# Altium project CW308T_LPC55S69_Target.PrjPcb
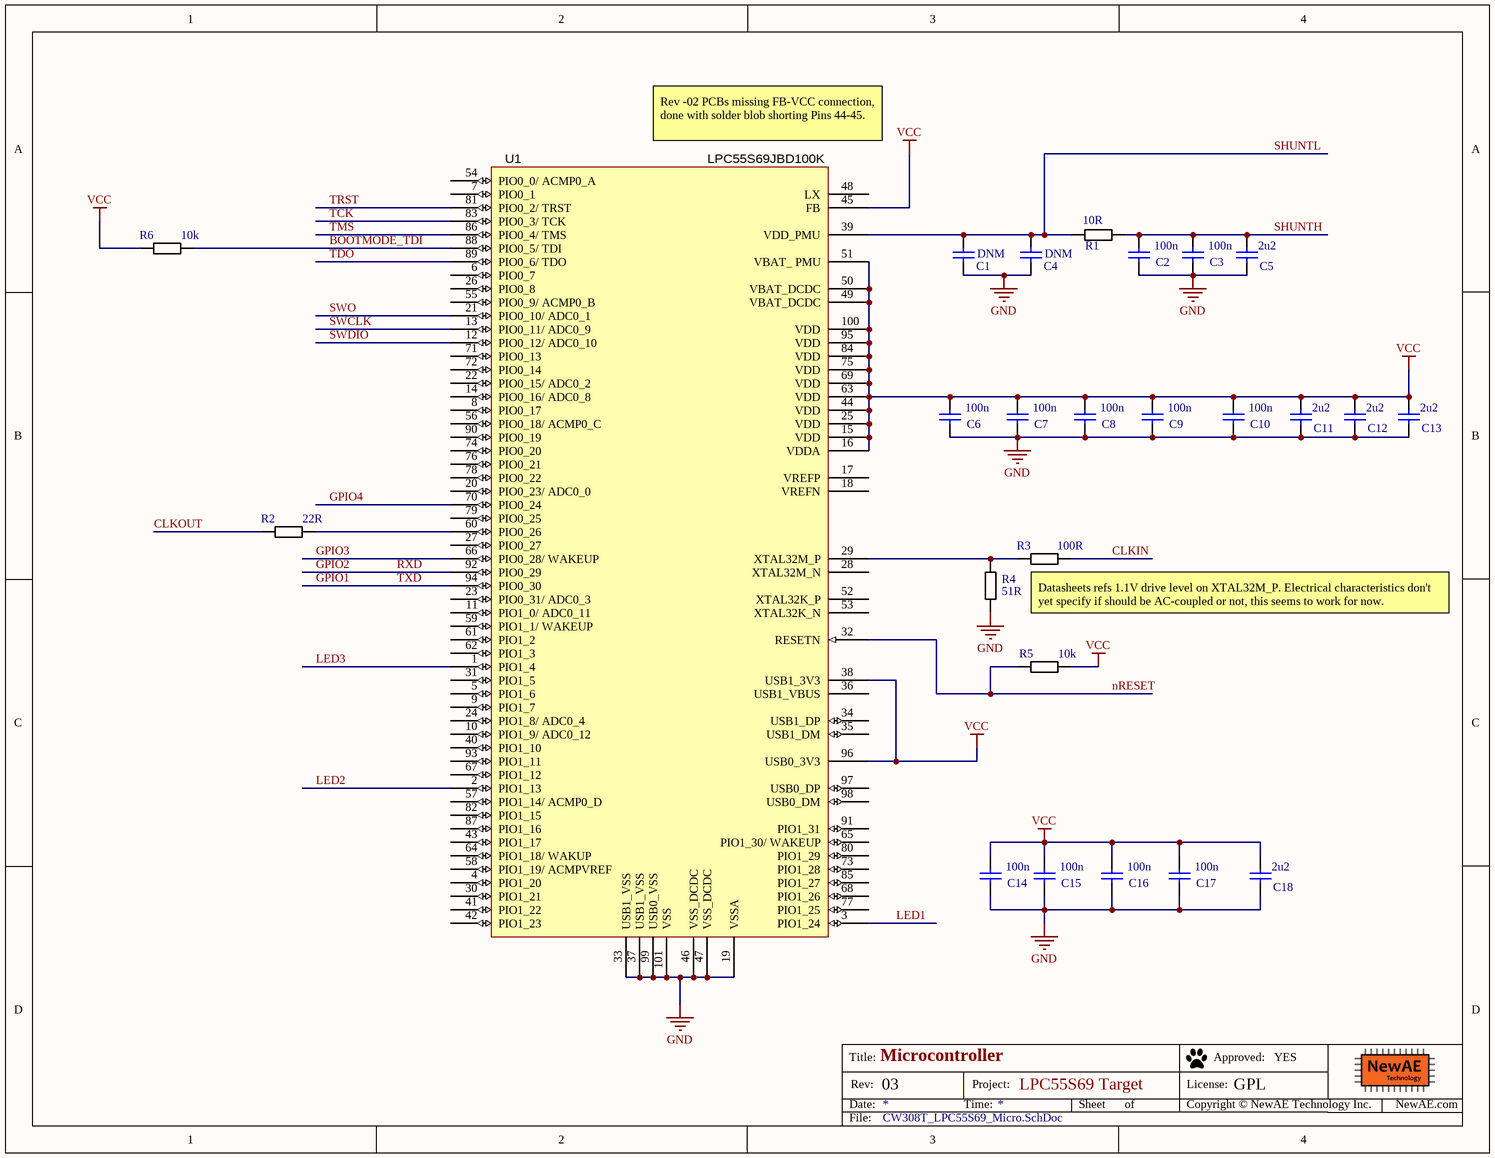
[diagram p0: CW308T_LPC55S69_Micro.SchDoc]
PrjRev: 03; PrjName: LPC55S69 Target; PrjLicense: GPL
2 sheets, 26 parts. Net scope: global (net labels, ports and power ports of the same name join across sheets).
Board files: CW308T_LPC55S69_MainPCB.PcbDoc, CW308T_LPC55S69_PANEL.PcbDoc
Sheets:
  CW308T_LPC55S69_Micro.SchDoc
  CW308T_LPC55S69_Main.SchDoc

## Sheet CW308T_LPC55S69_Micro.SchDoc: Microcontroller
size Letter; Organization: NewAE Technology Inc.; Address1: 1083 Queen St., Suite 196; Address2: Halifax; Address3: NS; Address4: Canada B3H 0B2; SheetApproved: YES

### Parts
C1  DNM  [CAPC0603_M]
C2  100n  [CAPC0603_M]
C3  100n  [CAPC0603_M]
C4  DNM  [CAPC0603_M]
C5  2u2  [CAPC0603_M]
C6  100n  [CAPC0603_M]
C7  100n  [CAPC0603_M]
C8  100n  [CAPC0603_M]
C9  100n  [CAPC0603_M]
C10  100n  [CAPC0603_M]
C11  2u2  [CAPC0603_M]
C12  2u2  [CAPC0603_M]
C13  2u2  [CAPC0603_M]
C14  100n  [CAPC0603_M]
C15  100n  [CAPC0603_M]
C16  100n  [CAPC0603_M]
C17  100n  [CAPC0603_M]
C18  2u2  [CAPC0603_M]
R1  10R  [RESC1608X55N]
R2  22R  [RESC1608X55N]
R3  100R  [RESC1608X55N]
R4  51R  [RESC1608X55N]
R5  10k  [RESC1608X55N]
R6  10k  [RESC1608X55N]
U1  LPC55S69JBD100K  [PG-TQFP-100-PG-NXP]

### Nets
GND: C1.2 C2.2 C3.2 C4.2 C5.2 C6.2 C7.2 C8.2 C9.2 C10.2 C11.2 C12.2 C13.2 C14.2 C15.2 C16.2 C17.2 C18.2 R4.2 U1.19(VSSA) U1.33(USB1_VSS) U1.37(USB1_VSS) U1.46(VSS_DCDC) U1.47(VSS_DCDC) U1.99(USB0_VSS) U1.101(VSS)
VCC: C6.1 C7.1 C8.1 C9.1 C10.1 C11.1 C12.1 C13.1 C14.1 C15.1 C16.1 C17.1 C18.1 R5.2 R6.1 U1.15(VDD) U1.16(VDDA) U1.25(VDD) U1.38(USB1_3V3) U1.44(VDD) U1.45(FB) U1.49(VBAT_DCDC) U1.50(VBAT_DCDC) U1.51(VBAT__PMU) U1.63(VDD) U1.69(VDD) U1.75(VDD) U1.84(VDD) U1.95(VDD) U1.96(USB0_3V3) U1.100(VDD)
BOOTMODE_TDI: R6.2 U1.88(PIO0_5/_TDI)
CLKIN: R3.2
CLKOUT: R2.1
GPIO1: U1.94(PIO0_30)  [also labelled TXD]
GPIO2: U1.92(PIO0_29)  [also labelled RXD]
GPIO3: U1.66(PIO0_28/_WAKEUP)
GPIO4: U1.70(PIO0_24)
LED1: U1.3(PIO1_24)
LED2: U1.2(PIO1_13)
LED3: U1.1(PIO1_4)
nRESET: R5.1 U1.32(RESETN)
SHUNTH: C2.1 C3.1 C5.1 R1.2
SHUNTL: C1.1 C4.1 R1.1 U1.39(VDD_PMU)
SWCLK: U1.13(PIO0_11/_ADC0_9)
SWDIO: U1.12(PIO0_12/_ADC0_10)
SWO: U1.21(PIO0_10/_ADC0_1)
TCK: U1.83(PIO0_3/_TCK)
TDO: U1.89(PIO0_6/_TDO)
TMS: U1.86(PIO0_4/_TMS)
TRST: U1.81(PIO0_2/_TRST)
NetR2_2: R2.2 U1.60(PIO0_26)
NetR3_1: R3.1 R4.1 U1.29(XTAL32M_P)

Not connected (* = marked no-connect by the designer): U1 4(PIO1_20) 5(PIO1_6) 6(PIO0_7) 7(PIO0_1) 8(PIO0_17) 9(PIO1_7) 10(PIO1_9/_ADC0_12) 11(PIO1_0/_ADC0_11) 14(PIO0_16/_ADC0_8) 17(VREFP) 18(VREFN) 20(PIO0_23/_ADC0_0) 22(PIO0_15/_ADC0_2) 23(PIO0_31/_ADC0_3) 24(PIO1_8/_ADC0_4) 26(PIO0_8) 27(PIO0_27) 28(XTAL32M_N) 30(PIO1_21) 31(PIO1_5) 34(USB1_DP) 35(USB1_DM) 36(USB1_VBUS) 40(PIO1_10) 41(PIO1_22) 42(PIO1_23) 43(PIO1_17) 48(LX) 52(XTAL32K_P) 53(XTAL32K_N) 54(PIO0_0/_ACMP0_A) 55(PIO0_9/_ACMP0_B) 56(PIO0_18/_ACMP0_C) 57(PIO1_14/_ACMP0_D) 58(PIO1_19/_ACMPVREF) 59(PIO1_1/_WAKEUP) 61(PIO1_2) 62(PIO1_3) 64(PIO1_18/_WAKUP) 65(PIO1_30/_WAKEUP) 67(PIO1_12) 68(PIO1_26) 71(PIO0_13) 72(PIO0_14) 73(PIO1_28) 74(PIO0_20) 76(PIO0_21) 77(PIO1_25) 78(PIO0_22) 79(PIO0_25) 80(PIO1_29) 82(PIO1_15) 85(PIO1_27) 87(PIO1_16) 90(PIO0_19) 91(PIO1_31) 93(PIO1_11) 97(USB0_DP) 98(USB0_DM)

### Notes on the sheet
- (near U1) Rev -02 PCBs missing FB-VCC connection, done with solder blob shorting Pins 44-45.
- (near R3) Datasheets refs 1.1V drive level on XTAL32M_P. Electrical characteristics don't yet specify if should be AC-coupled or not, this seems to work for now.
- Title:
- Date:
- Rev:
- Time:
- Project:
- Sheet
- of
- License:
- Copyright © NewAE Technology Inc.
- Approved:
- NewAE.com
- File:

### Library data of the parts
C1 C4 = CCHIP-DNM-0603: DNM, 0603; Component Group: Capacitor; Case-EIA: 0603; Part Number: CCHIP-DNM-0603; Footprint: 0603; Pin Count: 2; Value: DNM; Mounting Technology: SMT; Component Kind: Standard; Component Type: Standard
C2 C3 C6-C10 C14-C17 = CCHIP-100n-0603: 100n, 0603; Manufacture 1: Kemet; Manufacture Part Number 1: C0603C104K5RACTU; Component Group: Capacitor; Case-EIA: 0603; Case-Metric: 1608; Rated Voltage: 50VDC; Part Number: CCHIP-100n-0603; Footprint: 0603; Pin Count: 2; Supplier 1: Digi-Key; Supplier Part Number 1: 399-5089-2-ND; Value: 100n; Mounting Technology: SMT; Component Kind: Standard; Component Type: Standard
C5 C11-C13 C18 = CCHIP-2u2-0603: 2u2, 0603; Manufacture 1: Samsung; Manufacture Part Number 1: CL10B225KP8NNNC; Component Group: Capacitor; Case-EIA: 0603; Case-Metric: 1608; Rated Voltage: 10VDC; Part Number: CCHIP-2u2-0603; Footprint: 0603; Pin Count: 2; Supplier 1: Digi-Key; Supplier Part Number 1: 1276-1134-2-ND; Value: 2u2; Mounting Technology: SMT; Component Kind: Standard; Component Type: Standard
R1 = RCHIP-10R-0603: 10R res, 0603, 1%, 1/10W; Manufacture 1: Yageo; Manufacture Part Number 1: RC0603FR-0710RL; Component Group: Resistor; Case-EIA: 0603; Case-Metric: 1608; Rated Power: 0.1W; Rated Voltage: 75VDC; Part Number: RCHIP-10R-0603; Footprint: 0603; Pin Count: 2; Supplier 1: Digi-Key; Supplier Part Number 1: 311-10.0HRCT-ND; Value: 10R; Tolerance: 1%; Mounting Technology: SMT; Temperature Range: -55C to 155C; Component Kind: Standard; Component Type: Standard
R2 = RCHIP-22R-0603: 22R res, 0603, 1%, 1/10W; Manufacture 1: Yageo; Manufacture Part Number 1: RC0603FR-0722RL; Component Group: Resistor; Case-EIA: 0603; Case-Metric: 1608; Rated Power: 0.1W; Rated Voltage: 75VDC; Part Number: RCHIP-22R-0603; Footprint: 0603; Pin Count: 2; Supplier 1: Digi-Key; Supplier Part Number 1: 311-22.0HRCT-ND; Value: 22R; Tolerance: 1%; Mounting Technology: SMT; Temperature Range: -55C to 155C; Component Kind: Standard; Component Type: Standard
R3 = RCHIP-100R-0603: 100R res, 0603, 1%, 1/10W; Manufacture 1: Yageo; Manufacture Part Number 1: RC0603FR-07100RL; Component Group: Resistor; Case-EIA: 0603; Case-Metric: 1608; Rated Power: 0.1W; Rated Voltage: 75VDC; Part Number: RCHIP-100R-0603; Footprint: 0603; Pin Count: 2; Supplier 1: Digi-Key; Supplier Part Number 1: 311-100HRCT-ND; Value: 100R; Tolerance: 1%; Mounting Technology: SMT; Temperature Range: -55C to 155C; Component Kind: Standard; Component Type: Standard
R4 = RCHIP-51R-0603: 51R res, 0603, 1%, 1/10W; Manufacture 1: Yageo; Manufacture Part Number 1: RC0603FR-0751RL; Component Group: Resistor; Case-EIA: 0603; Case-Metric: 1608; Rated Power: 0.1W; Rated Voltage: 75VDC; Part Number: RCHIP-51R-0603; Footprint: 0603; Pin Count: 2; Supplier 1: Digi-Key; Supplier Part Number 1: 311-51.0HRCT-ND; Value: 51R; Tolerance: 1%; Mounting Technology: SMT; Temperature Range: -55C to 155C; Component Kind: Standard; Component Type: Standard
R5 R6 = RCHIP-10K-0603: 10k res, 0603, 1%, 1/10W; Manufacture 1: Yageo; Manufacture Part Number 1: RC0603FR-0710KL; Component Group: Resistor; Case-EIA: 0603; Case-Metric: 1608; Rated Power: 0.1W; Rated Voltage: 75VDC; Part Number: RCHIP-10K-0603; Footprint: 0603; Pin Count: 2; Supplier 1: Digi-Key; Supplier Part Number 1: 311-10.0KHRCT-ND; Value: 10k; Tolerance: 1%; Mounting Technology: SMT; Temperature Range: -55C to 155C; Component Kind: Standard; Component Type: Standard
U1 = LPC55S69JBD100K: Cortex-m33, dual-core, security; Manufacture 1: NXP; Company_PN: <Enter Company P/N>; Component Group: Digital IC; PP Material Stack: 0; Created By: D.GODDARD; Part Number: LPC55S69JBD100K; Footprint: TQFP100; Manufacture Part Number 1: LPC55S69JBD100K; Pin Count: 101; Component Kind: Standard; Component Type: Standard; PP Rotation: 0

## Sheet CW308T_LPC55S69_Main.SchDoc: UFO Target
size Letter; Organization: NewAE Technology Inc.; Address1: 1083 Queen St., Suite 196; Address2: Halifax; Address3: NS; Address4: Canada B3H 0B2; SheetApproved: YES
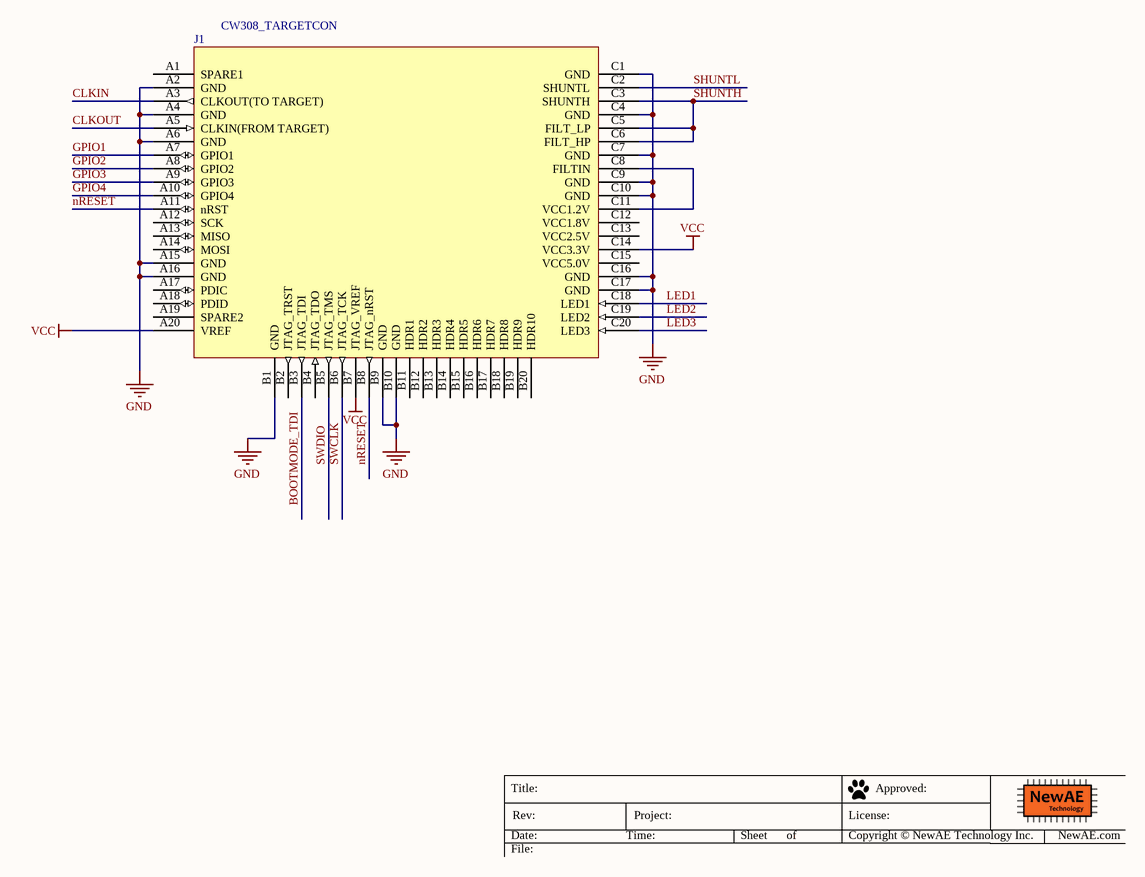
[diagram p1: CW308T_LPC55S69_Main.SchDoc]

### Parts
J1  CW308_TARGETCON  [CW308_TBOARD_CONN]

### Nets
GND: J1.A2(GND) J1.A4(GND) J1.A6(GND) J1.A15(GND) J1.A16(GND) J1.B1(GND) J1.B9(GND) J1.B10(GND) J1.C1(GND) J1.C4(GND) J1.C7(GND) J1.C9(GND) J1.C10(GND) J1.C16(GND) J1.C17(GND)
VCC: J1.A20(VREF) J1.B7(JTAG_VREF) J1.C14(VCC3.3V)
BOOTMODE_TDI: J1.B3(JTAG_TDI)
CLKIN: J1.A3(CLKOUT(TO_TARGET))
CLKOUT: J1.A5(CLKIN(FROM_TARGET))
GPIO1: J1.A7(GPIO1)
GPIO2: J1.A8(GPIO2)
GPIO3: J1.A9(GPIO3)
GPIO4: J1.A10(GPIO4)
LED1: J1.C18(LED1)
LED2: J1.C19(LED2)
LED3: J1.C20(LED3)
nRESET: J1.A11(nRST) J1.B8(JTAG_nRST)
SHUNTH: J1.C3(SHUNTH) J1.C5(FILT_LP) J1.C6(FILT_HP)
SHUNTL: J1.C2(SHUNTL)
SWCLK: J1.B6(JTAG_TCK)
SWDIO: J1.B5(JTAG_TMS)
NetJ1_C8: J1.C8(FILTIN) J1.C11(VCC1.2V)

Not connected (* = marked no-connect by the designer): J1 A1(SPARE1) A12(SCK) A13(MISO) A14(MOSI) A17(PDIC) A18(PDID) A19(SPARE2) B2(JTAG_TRST) B4(JTAG_TDO) B11(HDR1) B12(HDR2) B13(HDR3) B14(HDR4) B15(HDR5) B16(HDR6) B17(HDR7) B18(HDR8) B19(HDR9) B20(HDR10) C12(VCC1.8V) C13(VCC2.5V) C15(VCC5.0V)

### Notes on the sheet
- Title:
- Date:
- Rev:
- Time:
- Project:
- Sheet
- of
- License:
- Copyright © NewAE Technology Inc.
- Approved:
- NewAE.com
- File:

### Library data of the parts
J1 = CW308_TBOARD: CW308 "Standard" Target Board Connector; Component Group: Mechanical; Pitch: 2.54mm; Part Number: CW308_TBOARD; Pin Count: 60; Mounting Technology: Through-hole; Component Kind: Standard; Component Type: Standard

## Nets that join several sheets
GND: CW308T_LPC55S69_Micro (26 pins), CW308T_LPC55S69_Main (15 pins)
VCC: CW308T_LPC55S69_Micro (31 pins), CW308T_LPC55S69_Main (J1.A20 J1.B7 J1.C14)
BOOTMODE_TDI: CW308T_LPC55S69_Micro (R6.2 U1.88), CW308T_LPC55S69_Main (J1.B3)
CLKIN: CW308T_LPC55S69_Micro (R3.2), CW308T_LPC55S69_Main (J1.A3)
CLKOUT: CW308T_LPC55S69_Micro (R2.1), CW308T_LPC55S69_Main (J1.A5)
GPIO1: CW308T_LPC55S69_Micro (U1.94), CW308T_LPC55S69_Main (J1.A7)
GPIO2: CW308T_LPC55S69_Micro (U1.92), CW308T_LPC55S69_Main (J1.A8)
GPIO3: CW308T_LPC55S69_Micro (U1.66), CW308T_LPC55S69_Main (J1.A9)
GPIO4: CW308T_LPC55S69_Micro (U1.70), CW308T_LPC55S69_Main (J1.A10)
LED1: CW308T_LPC55S69_Micro (U1.3), CW308T_LPC55S69_Main (J1.C18)
LED2: CW308T_LPC55S69_Micro (U1.2), CW308T_LPC55S69_Main (J1.C19)
LED3: CW308T_LPC55S69_Micro (U1.1), CW308T_LPC55S69_Main (J1.C20)
nRESET: CW308T_LPC55S69_Micro (R5.1 U1.32), CW308T_LPC55S69_Main (J1.A11 J1.B8)
SHUNTH: CW308T_LPC55S69_Micro (C2.1 C3.1 C5.1 R1.2), CW308T_LPC55S69_Main (J1.C3 J1.C5 J1.C6)
SHUNTL: CW308T_LPC55S69_Micro (C1.1 C4.1 R1.1 U1.39), CW308T_LPC55S69_Main (J1.C2)
SWCLK: CW308T_LPC55S69_Micro (U1.13), CW308T_LPC55S69_Main (J1.B6)
SWDIO: CW308T_LPC55S69_Micro (U1.12), CW308T_LPC55S69_Main (J1.B5)